# EAGLE schematic Quest (EAGLE 6.3)
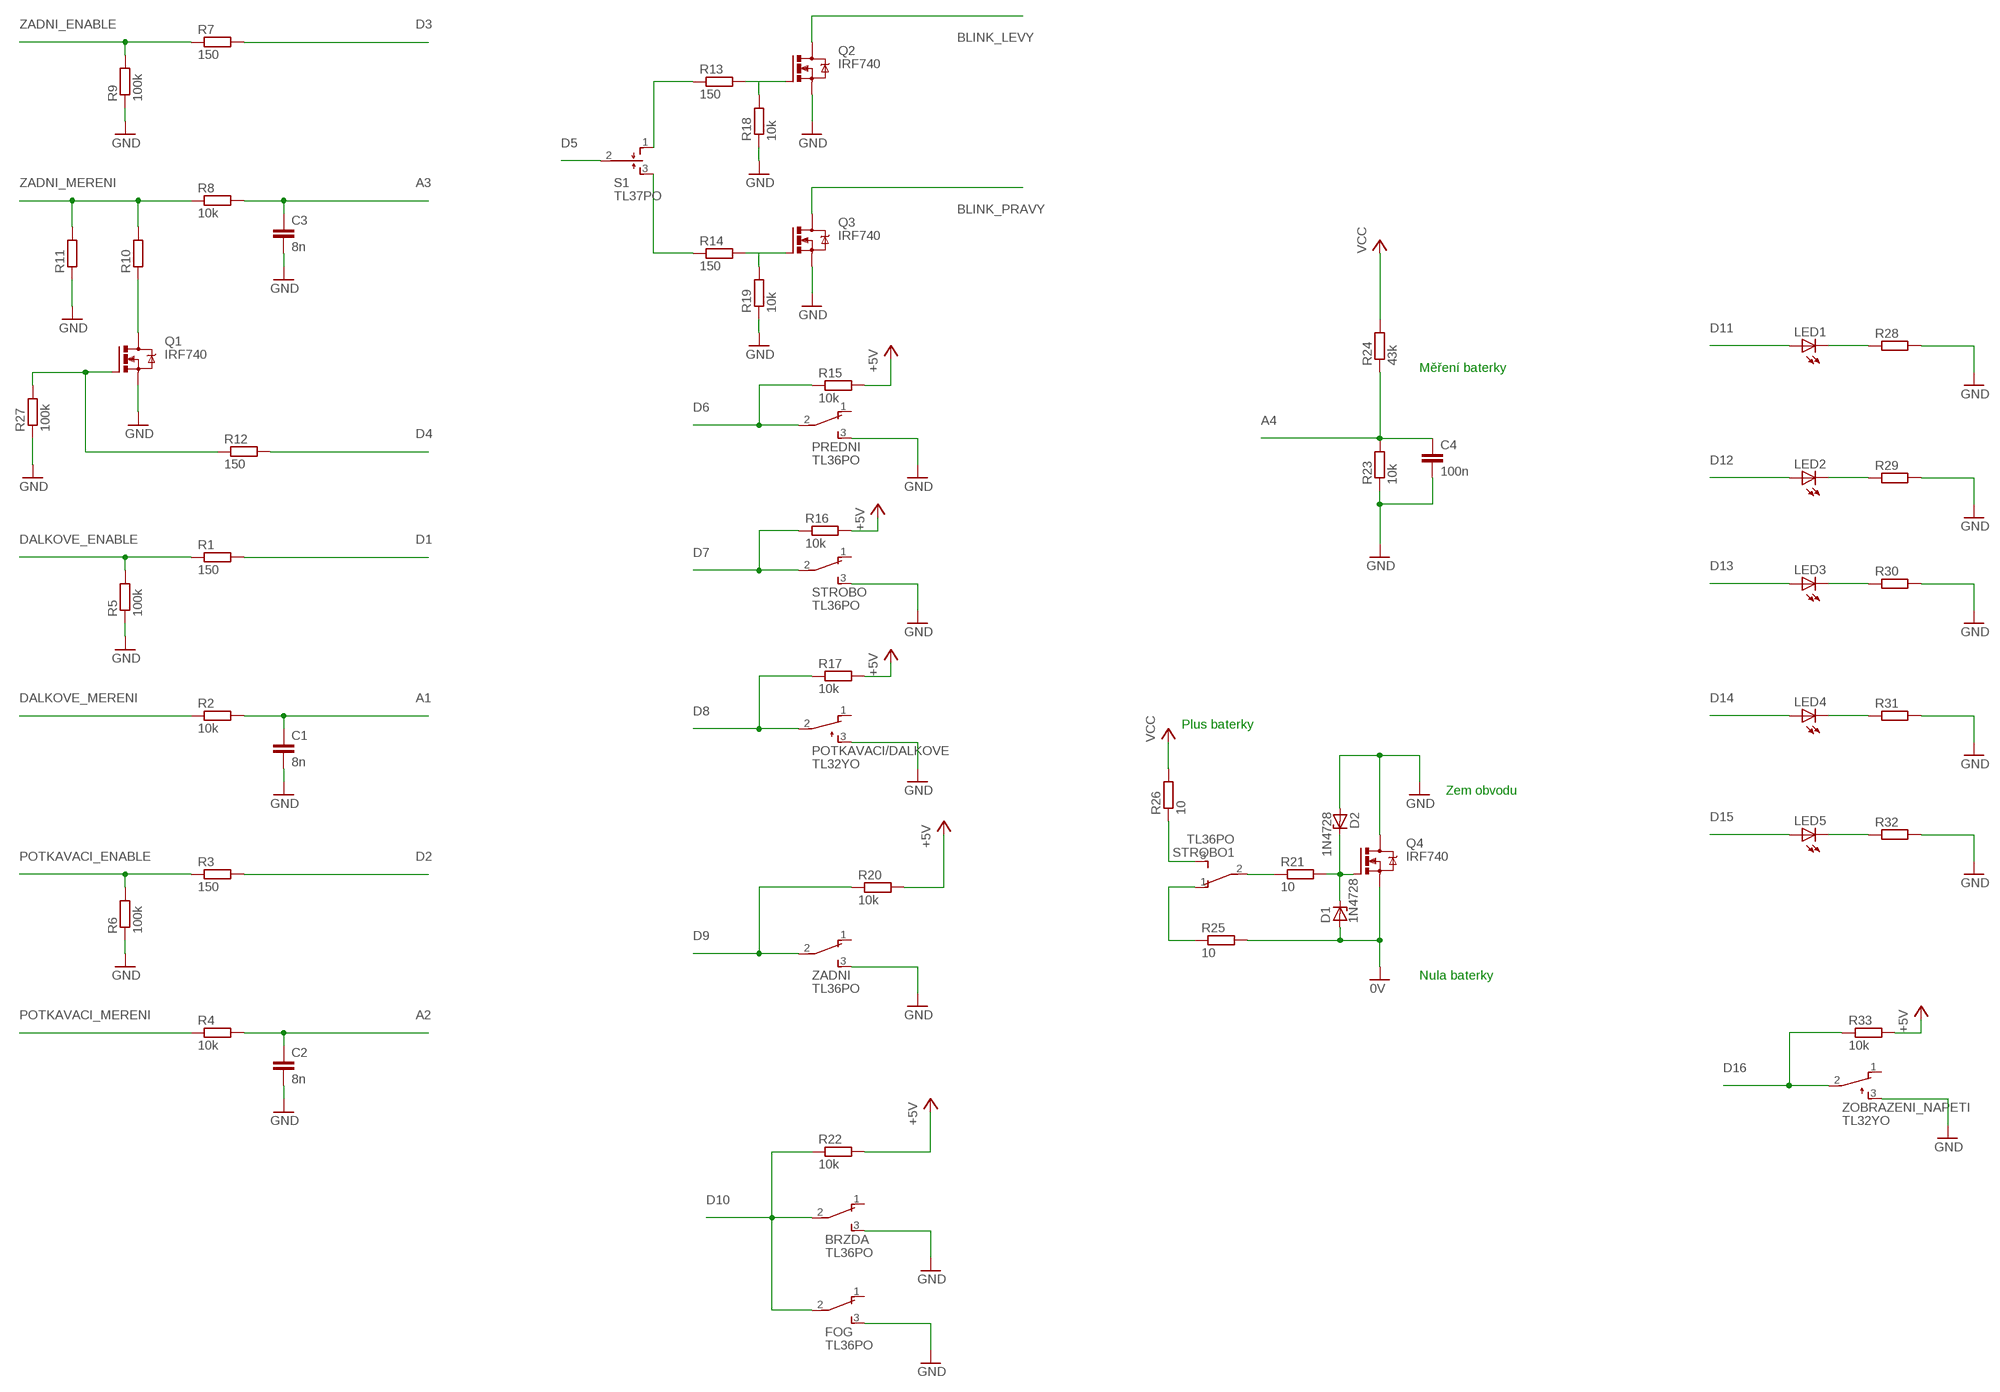
[diagram p0: schematic, sheet 1]

## Parts
BRZDA  TL36PO  [TL3XPO]
C1  8n  C-EU050-024X044  [C050-024X044]
C2  8n  C-EU050-024X044  [C050-024X044]
C3  8n  C-EU050-024X044  [C050-024X044]
C4  100n  C-EU050-024X044  [C050-024X044]
D1  1N4728  [DO41Z10]
D2  1N4728  [DO41Z10]
FOG  TL36PO  [TL3XPO]
LED1  LED5MM  [LED5MM]
LED2  LED5MM  [LED5MM]
LED3  LED5MM  [LED5MM]
LED4  LED5MM  [LED5MM]
LED5  LED5MM  [LED5MM]
POTKAVACI/DALKOVE  TL32YO  [TL3XYO]
PREDNI  TL36PO  [TL3XPO]
Q1  IRF740  [TO220BV]
Q2  IRF740  [TO220BV]
Q3  IRF740  [TO220BV]
Q4  IRF740  [TO220BV]
R1  150  R-EU_0309/10  [0309/10]
R2  10k  R-EU_0309/10  [0309/10]
R3  150  R-EU_0309/10  [0309/10]
R4  10k  R-EU_0309/10  [0309/10]
R5  100k  R-EU_0309/10  [0309/10]
R6  100k  R-EU_0309/10  [0309/10]
R7  150  R-EU_0309/10  [0309/10]
R8  10k  R-EU_0309/10  [0309/10]
R9  100k  R-EU_0309/10  [0309/10]
R10  R-EU_0309/10  [0309/10]
R11  R-EU_0309/10  [0309/10]
R12  150  R-EU_0309/10  [0309/10]
R13  150  R-EU_0309/10  [0309/10]
R14  150  R-EU_0309/10  [0309/10]
R15  10k  R-EU_0309/10  [0309/10]
R16  10k  R-EU_0309/10  [0309/10]
R17  10k  R-EU_0309/10  [0309/10]
R18  10k  R-EU_0309/10  [0309/10]
R19  10k  R-EU_0309/10  [0309/10]
R20  10k  R-EU_0309/10  [0309/10]
R21  10  R-EU_0309/10  [0309/10]
R22  10k  R-EU_0309/10  [0309/10]
R23  10k  R-EU_0309/10  [0309/10]
R24  43k  R-EU_0309/10  [0309/10]
R25  10  R-EU_0309/10  [0309/10]
R26  10  R-EU_0309/10  [0309/10]
R27  100k  R-EU_0309/10  [0309/10]
R28  R-EU_0309/10  [0309/10]
R29  R-EU_0309/10  [0309/10]
R30  R-EU_0309/10  [0309/10]
R31  R-EU_0309/10  [0309/10]
R32  R-EU_0309/10  [0309/10]
R33  10k  R-EU_0309/10  [0309/10]
S1  TL37PO  [TL3XPO]
STROBO  TL36PO  [TL3XPO]
STROBO1  TL36PO  [TL3XPO]
ZADNI  TL36PO  [TL3XPO]
ZOBRAZENI_NAPETI  TL32YO  [TL3XYO]

## Nets
0V: D1.A Q4.S R25.2
+5V: R15.2 R16.2 R17.2 R20.2 R22.2 R33.2
A1: C1.1 R2.2
A2: C2.1 R4.2
A3: C3.1 R8.2
A4: C4.1 R23.2 R24.1
BLINK_LEVY: Q2.D
BLINK_PRAVY: Q3.D
D1: R1.2
D2: R3.2
D3: R7.2
D4: R12.2
D5: S1.2(P)
D6: PREDNI.2(P) R15.1
D7: R16.1 STROBO.2(P)
D8: POTKAVACI/DALKOVE.2(P) R17.1
D9: R20.1 ZADNI.2(P)
D10: BRZDA.2(P) FOG.2(P) R22.1
D11: LED1.A
D12: LED2.A
D13: LED3.A
D14: LED4.A
D15: LED5.A
D16: R33.1 ZOBRAZENI_NAPETI.2(P)
DALKOVE_ENABLE: R1.1 R5.2
DALKOVE_MERENI: R2.1
GND: BRZDA.3(S) C1.2 C2.2 C3.2 C4.2 D2.A FOG.3(S) POTKAVACI/DALKOVE.3(S) PREDNI.3(S) Q1.S Q2.S Q3.S Q4.D R5.1 R6.1 R9.1 R11.1 R18.1 R19.1 R23.1 R27.1 R28.2 R29.2 R30.2 R31.2 R32.2 STROBO.3(S) ZADNI.3(S) ZOBRAZENI_NAPETI.3(S)
N$1: Q1.D R10.1
N$2: Q3.G R14.2 R19.2
N$3: Q1.G R12.1 R27.2
N$4: Q2.G R13.2 R18.2
N$5: R14.1 S1.3(S)
N$6: R13.1 S1.1(O)
N$7: D1.C D2.C Q4.G R21.2
N$8: R26.1 STROBO1.3(S)
N$9: R21.1 STROBO1.2(P)
N$10: LED2.K(C) R29.1
N$11: R25.1 STROBO1.1(O)
N$12: LED1.K(C) R28.1
N$13: LED3.K(C) R30.1
N$14: LED4.K(C) R31.1
N$15: LED5.K(C) R32.1
POTKAVACI_ENABLE: R3.1 R6.2
POTKAVACI_MERENI: R4.1
VCC: R24.2 R26.2
ZADNI_ENABLE: R7.1 R9.2
ZADNI_MERENI: R8.1 R10.2 R11.2
Unconnected: BRZDA.1(O) FOG.1(O) POTKAVACI/DALKOVE.1(O) PREDNI.1(O) STROBO.1(O) ZADNI.1(O) ZOBRAZENI_NAPETI.1(O)

## Notes on the sheet
- Měření baterky
- Plus baterky
- Zem obvodu
- Nula baterky

## Library data of the parts
BRZDA FOG PREDNI STROBO STROBO1 ZADNI = switch:TL36PO: TINY SWITCH ON - ON Source: http://www2.produktinfo.conrad.com/datenblaetter/700000-724999/705152-da-01-de-Subminiaturschalter_TL_36YO.pdf
C1-C4 = rcl:C-EU: CAPACITOR, European symbol
D1 D2 = diode:1N4728: Z DIODE 3.3 V, 1W, 5 percent
LED1-LED5 = led:LED: LED OSRAM: - CHIPLED LG R971, LG N971, LY N971, LG Q971, LY Q971, LO R971, LY R971 LH N974, LH R974 LS Q976, LO Q976, LY Q976 LO Q996 - Hyper CHIPLED LW Q18S LB Q993, LB Q99A, LB R99A - SideLED LS A670, LO A670, LY A670, LG A670, LP A670 LB A673, LV A673, LT A673, LW A673 LH A674 LY A675 LS A676, LA A676, LO A676, LY A676, LW A676 LS A679, LY A679, LG A679 - Hyper Micro SIDELED® LS Y876, LA Y876, LO Y876, LY Y876 LT Y87S - SmartLED LW L88C, LW L88S LB L89C, LB L89S, LG L890 LS L89K, LO L89K, LY L89K LS L896, LA L896, LO L896, LY L896 - TOPLED LS T670, LO T670, LY T670, LG T670, LP T670 LSG T670, LSP T670, LSY T670, LOP T670, LYG T670 LG T671, LOG T671, LSG T671 LB T673, LV T673, LT T673, LW T673 LH T674 LS T676, LA T676, LO T676, LY T676, LB T676, LH T676, LSB T676, LW T676 LB T67C, LV T67C, LT T67C, LS T67K, LO T67K, LY T67K, LW E67C LS E67B, LA E67B, LO E67B, LY E67B, LB E67C, LV E67C, LT E67C LW T67C LS T679, LY T679, LG T679 LS T770, LO T770, LY T770, LG T770, LP T770 LB T773, LV T773, LT T773, LW T773 LH T774 LS E675, LA E675, LY E675, LS T675 LS T776, LA T776, LO T776, LY T776, LB T776 LHGB T686 LT T68C, LB T68C - Hyper Mini TOPLED® LB M676 - Mini TOPLED Santana® LG M470 LS M47K, LO M47K, LY M47K Source: http://www.osram.convergy.de LUXEON: - LUMILED® LXK2-PW12-R00, LXK2-PW12-S00, LXK2-PW14-U00, LXK2-PW14-V00 LXK2-PM12-R00, LXK2-PM12-S00, LXK2-PM14-U00 LXK2-PE12-Q00, LXK2-PE12-R00, LXK2-PE12-S00, LXK2-PE14-T00, LXK2-PE14-U00 LXK2-PB12-K00, LXK2-PB12-L00, LXK2-PB12-M00, LXK2-PB14-N00, LXK2-PB14-P00, LXK2-PB14-Q00 LXK2-PR12-L00, LXK2-PR12-M00, LXK2-PR14-Q00, LXK2-PR14-R00 LXK2-PD12-Q00, LXK2-PD12-R00, LXK2-PD12-S00 LXK2-PH12-R00, LXK2-PH12-S00 LXK2-PL12-P00, LXK2-PL12-Q00, LXK2-PL12-R00 Source: www.luxeon.com KINGBRIGHT: KA-3528ASYC Source: www.kingbright.com
POTKAVACI/DALKOVE ZOBRAZENI_NAPETI = switch:TL32YO: TINY SWITCH ON - MOM Source: http://www2.produktinfo.conrad.com/datenblaetter/700000-724999/705152-da-01-de-Subminiaturschalter_TL_36YO.pdf
Q1-Q4 = transistor-power:IRF740: N-CHANNEL MOS FET
R1-R33 = rcl:R-EU_: RESISTOR, European symbol
S1 = switch:TL37PO: TINY SWITCH MOM OFF MOM Source: http://www2.produktinfo.conrad.com/datenblaetter/700000-724999/705152-da-01-de-Subminiaturschalter_TL_36YO.pdf